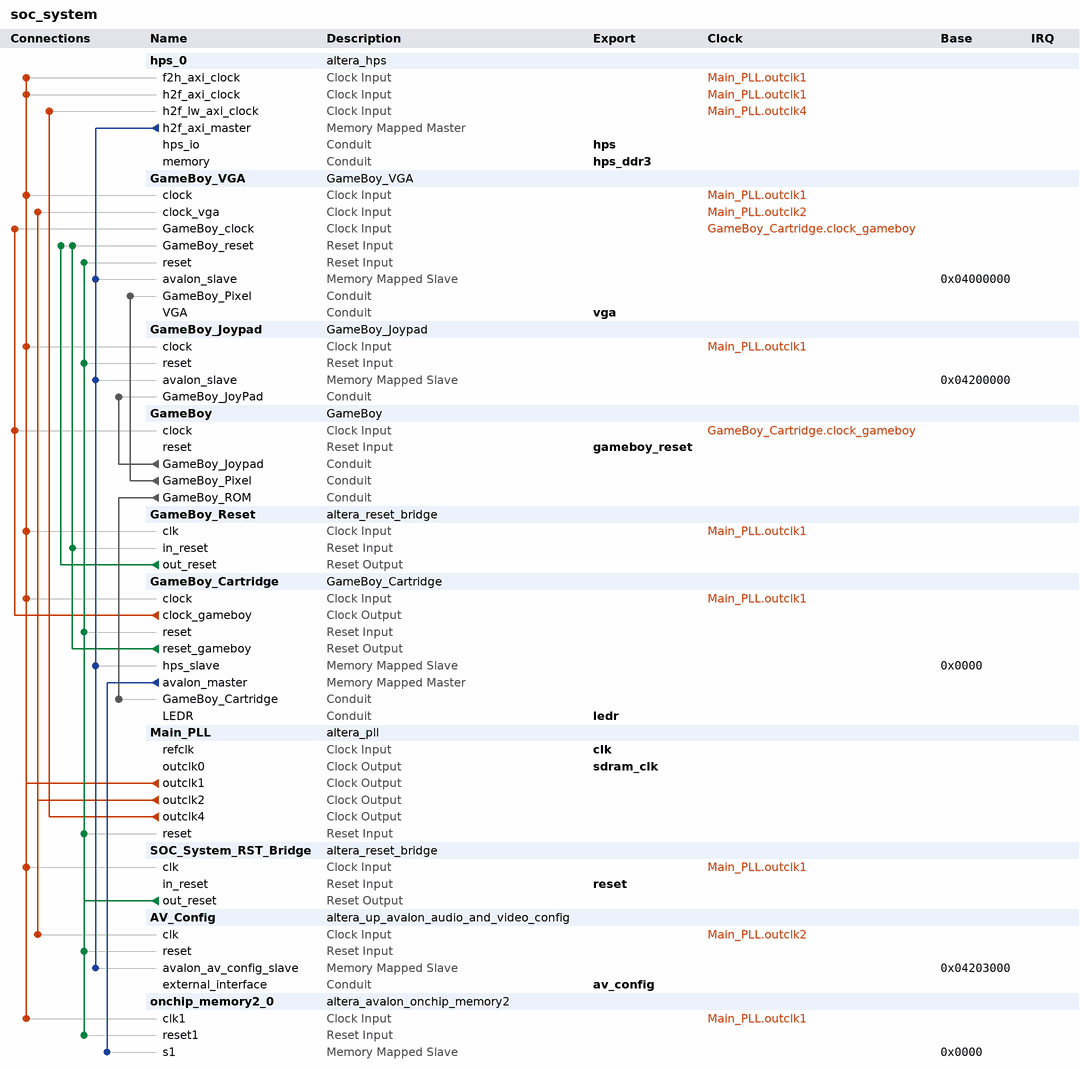
[diagram p0: system contents]
# Platform Designer (Qsys) system soc_system, Cyclone V 5CSEMA5F31C6
# Parameters at their usual value, and those the tool derives, are not listed.
package require -exact qsys 21.1
create_system soc_system
set_project_property DEVICE_FAMILY {Cyclone V}
set_project_property DEVICE 5CSEMA5F31C6

add_instance hps_0 altera_hps 21.1
set_instance_parameter_value hps_0 EMAC1_Mode RGMII
set_instance_parameter_value hps_0 EMAC1_PinMuxing {HPS I/O Set 0}
set_instance_parameter_value hps_0 F2SCLK_COLDRST_Enable false
set_instance_parameter_value hps_0 F2SCLK_DBGRST_Enable false
set_instance_parameter_value hps_0 F2SCLK_WARMRST_Enable false
set_instance_parameter_value hps_0 F2SINTERRUPT_Enable true
set_instance_parameter_value hps_0 F2S_Width 2
set_instance_parameter_value hps_0 FPGA_PERIPHERAL_OUTPUT_CLOCK_FREQ_EMAC0_GTX_CLK 125
set_instance_parameter_value hps_0 FPGA_PERIPHERAL_OUTPUT_CLOCK_FREQ_EMAC0_MD_CLK 2.5
set_instance_parameter_value hps_0 FPGA_PERIPHERAL_OUTPUT_CLOCK_FREQ_EMAC1_GTX_CLK 125
set_instance_parameter_value hps_0 FPGA_PERIPHERAL_OUTPUT_CLOCK_FREQ_EMAC1_MD_CLK 2.5
set_instance_parameter_value hps_0 HPS_PROTOCOL DDR3
set_instance_parameter_value hps_0 I2C0_Mode I2C
set_instance_parameter_value hps_0 I2C0_PinMuxing {HPS I/O Set 0}
set_instance_parameter_value hps_0 I2C1_Mode I2C
set_instance_parameter_value hps_0 I2C1_PinMuxing {HPS I/O Set 0}
set_instance_parameter_value hps_0 LWH2F_Enable true
set_instance_parameter_value hps_0 MEM_BANKADDR_WIDTH 3
set_instance_parameter_value hps_0 MEM_CLK_FREQ 400.0
set_instance_parameter_value hps_0 MEM_COL_ADDR_WIDTH 10
set_instance_parameter_value hps_0 MEM_DQ_WIDTH 32
set_instance_parameter_value hps_0 MEM_DRV_STR RZQ/7
set_instance_parameter_value hps_0 MEM_ROW_ADDR_WIDTH 15
set_instance_parameter_value hps_0 MEM_RTT_NOM RZQ/4
set_instance_parameter_value hps_0 MEM_RTT_WR RZQ/4
set_instance_parameter_value hps_0 MEM_TCL 11
set_instance_parameter_value hps_0 MEM_TFAW_NS 30.0
set_instance_parameter_value hps_0 MEM_TRAS_NS 35.0
set_instance_parameter_value hps_0 MEM_TRCD_NS 13.75
set_instance_parameter_value hps_0 MEM_TRFC_NS 260.0
set_instance_parameter_value hps_0 MEM_TRP_NS 13.75
set_instance_parameter_value hps_0 MEM_TRRD_NS 7.7
set_instance_parameter_value hps_0 MEM_VENDOR JEDEC
set_instance_parameter_value hps_0 MEM_WTCL 8
set_instance_parameter_value hps_0 QSPI_Mode N/A
set_instance_parameter_value hps_0 QSPI_PinMuxing Unused
set_instance_parameter_value hps_0 REF_CLK_FREQ 25.0
set_instance_parameter_value hps_0 S2FCLK_USER1CLK_Enable true
set_instance_parameter_value hps_0 S2FCLK_USER2CLK 5
set_instance_parameter_value hps_0 S2F_Width 2
set_instance_parameter_value hps_0 SDIO_Mode {4-bit Data}
set_instance_parameter_value hps_0 SDIO_PinMuxing {HPS I/O Set 0}
set_instance_parameter_value hps_0 SPIM1_Mode {Single Slave Select}
set_instance_parameter_value hps_0 SPIM1_PinMuxing {HPS I/O Set 0}
set_instance_parameter_value hps_0 STM_Enable false
set_instance_parameter_value hps_0 TIMING_BOARD_AC_SKEW 0.03
set_instance_parameter_value hps_0 TIMING_BOARD_AC_TO_CK_SKEW 0.0
set_instance_parameter_value hps_0 TIMING_BOARD_DQ_TO_DQS_SKEW 0.0
set_instance_parameter_value hps_0 TIMING_BOARD_MAX_CK_DELAY 0.03
set_instance_parameter_value hps_0 TIMING_BOARD_MAX_DQS_DELAY 0.02
set_instance_parameter_value hps_0 TIMING_BOARD_SKEW_BETWEEN_DQS 0.08
set_instance_parameter_value hps_0 TIMING_BOARD_SKEW_CKDQS_DIMM_MAX 0.16
set_instance_parameter_value hps_0 TIMING_BOARD_SKEW_CKDQS_DIMM_MIN 0.09
set_instance_parameter_value hps_0 TIMING_BOARD_SKEW_WITHIN_DQS 0.01
set_instance_parameter_value hps_0 TIMING_TDH 65
set_instance_parameter_value hps_0 TIMING_TDQSCK 255
set_instance_parameter_value hps_0 TIMING_TDQSQ 125
set_instance_parameter_value hps_0 TIMING_TDS 30
set_instance_parameter_value hps_0 TIMING_TIH 140
set_instance_parameter_value hps_0 TIMING_TIS 180
set_instance_parameter_value hps_0 TIMING_TQSH 0.4
set_instance_parameter_value hps_0 UART0_Mode {No Flow Control}
set_instance_parameter_value hps_0 UART0_PinMuxing {HPS I/O Set 0}
set_instance_parameter_value hps_0 USB1_Mode SDR
set_instance_parameter_value hps_0 USB1_PinMuxing {HPS I/O Set 0}
set_instance_parameter_value hps_0 desired_cfg_clk_mhz 100.0
set_instance_parameter_value hps_0 desired_qspi_clk_mhz 400.0

add_instance GameBoy_VGA GameBoy_VGA 1.0

add_instance GameBoy_Joypad GameBoy_Joypad 1.0

add_instance GameBoy GameBoy 1.0

add_instance GameBoy_Reset altera_reset_bridge 21.1
set_instance_parameter_value GameBoy_Reset ACTIVE_LOW_RESET 0
set_instance_parameter_value GameBoy_Reset SYNCHRONOUS_EDGES both

add_instance GameBoy_Cartridge GameBoy_Cartridge 1.0

add_instance Main_PLL altera_pll 21.1
set_instance_parameter_value Main_PLL gui_actual_output_clock_frequency2 {25.303342 MHz}
set_instance_parameter_value Main_PLL gui_device_speed_grade 2
set_instance_parameter_value Main_PLL gui_number_of_clocks 5
set_instance_parameter_value Main_PLL gui_operation_mode direct
set_instance_parameter_value Main_PLL gui_output_clock_frequency0 67.108864
set_instance_parameter_value Main_PLL gui_output_clock_frequency1 67.108864
set_instance_parameter_value Main_PLL gui_output_clock_frequency2 108.0
set_instance_parameter_value Main_PLL gui_output_clock_frequency3 12.288
set_instance_parameter_value Main_PLL gui_phase_shift0 -3000
set_instance_parameter_value Main_PLL gui_pll_mode {Fractional-N PLL}
set_instance_parameter_value Main_PLL gui_reference_clock_frequency 50.0
set_instance_parameter_value Main_PLL gui_use_locked false

add_instance SOC_System_RST_Bridge altera_reset_bridge 21.1
set_instance_parameter_value SOC_System_RST_Bridge ACTIVE_LOW_RESET 0
set_instance_parameter_value SOC_System_RST_Bridge SYNCHRONOUS_EDGES both

add_instance AV_Config altera_up_avalon_audio_and_video_config 18.0
set_instance_parameter_value AV_Config audio_in {Line In to ADC}
set_instance_parameter_value AV_Config bit_length 16
set_instance_parameter_value AV_Config board DE1-SoC
set_instance_parameter_value AV_Config line_in_bypass false
set_instance_parameter_value AV_Config sampling_rate {48 kHz}

add_instance onchip_memory2_0 altera_avalon_onchip_memory2 21.1
set_instance_parameter_value onchip_memory2_0 dataWidth 8
set_instance_parameter_value onchip_memory2_0 dualPort false
set_instance_parameter_value onchip_memory2_0 initMemContent true
set_instance_parameter_value onchip_memory2_0 initializationFileName onchip_mem.hex
set_instance_parameter_value onchip_memory2_0 memorySize 65536

# connections
add_connection GameBoy_Cartridge.clock_gameboy GameBoy.clock clock
add_connection GameBoy_Cartridge.clock_gameboy GameBoy_VGA.GameBoy_clock clock
add_connection Main_PLL.outclk1 GameBoy_Cartridge.clock clock
add_connection Main_PLL.outclk1 GameBoy_Joypad.clock clock
add_connection Main_PLL.outclk1 GameBoy_Reset.clk clock
add_connection Main_PLL.outclk1 GameBoy_VGA.clock clock
add_connection Main_PLL.outclk1 hps_0.f2h_axi_clock clock
add_connection Main_PLL.outclk1 hps_0.h2f_axi_clock clock
add_connection Main_PLL.outclk1 onchip_memory2_0.clk1 clock
add_connection Main_PLL.outclk1 SOC_System_RST_Bridge.clk clock
add_connection Main_PLL.outclk2 AV_Config.clk clock
add_connection Main_PLL.outclk2 GameBoy_VGA.clock_vga clock
add_connection Main_PLL.outclk4 hps_0.h2f_lw_axi_clock clock
add_connection GameBoy_Cartridge.reset_gameboy GameBoy_Reset.in_reset reset
add_connection GameBoy_Cartridge.reset_gameboy GameBoy_VGA.GameBoy_reset reset
add_connection GameBoy_Reset.out_reset GameBoy_VGA.GameBoy_reset reset
add_connection SOC_System_RST_Bridge.out_reset AV_Config.reset reset
add_connection SOC_System_RST_Bridge.out_reset GameBoy_Cartridge.reset reset
add_connection SOC_System_RST_Bridge.out_reset GameBoy_Joypad.reset reset
add_connection SOC_System_RST_Bridge.out_reset GameBoy_VGA.reset reset
add_connection SOC_System_RST_Bridge.out_reset Main_PLL.reset reset
add_connection SOC_System_RST_Bridge.out_reset onchip_memory2_0.reset1 reset
add_connection GameBoy_Cartridge.avalon_master onchip_memory2_0.s1 avalon
set_connection_parameter_value GameBoy_Cartridge.avalon_master/onchip_memory2_0.s1 baseAddress 0x0000
add_connection hps_0.h2f_axi_master AV_Config.avalon_av_config_slave avalon
set_connection_parameter_value hps_0.h2f_axi_master/AV_Config.avalon_av_config_slave baseAddress 0x04203000
add_connection hps_0.h2f_axi_master GameBoy_Cartridge.hps_slave avalon
set_connection_parameter_value hps_0.h2f_axi_master/GameBoy_Cartridge.hps_slave baseAddress 0x0000
add_connection hps_0.h2f_axi_master GameBoy_Joypad.avalon_slave avalon
set_connection_parameter_value hps_0.h2f_axi_master/GameBoy_Joypad.avalon_slave baseAddress 0x04200000
add_connection hps_0.h2f_axi_master GameBoy_VGA.avalon_slave avalon
set_connection_parameter_value hps_0.h2f_axi_master/GameBoy_VGA.avalon_slave baseAddress 0x04000000
add_connection GameBoy.GameBoy_Joypad GameBoy_Joypad.GameBoy_JoyPad conduit
add_connection GameBoy.GameBoy_Pixel GameBoy_VGA.GameBoy_Pixel conduit
add_connection GameBoy.GameBoy_ROM GameBoy_Cartridge.GameBoy_Cartridge conduit

# exported interfaces
add_interface av_config conduit end
set_interface_property av_config EXPORT_OF AV_Config.external_interface
add_interface clk clock sink
set_interface_property clk EXPORT_OF Main_PLL.refclk
add_interface gameboy_reset reset sink
set_interface_property gameboy_reset EXPORT_OF GameBoy.reset
add_interface hps conduit end
set_interface_property hps EXPORT_OF hps_0.hps_io
add_interface hps_ddr3 conduit end
set_interface_property hps_ddr3 EXPORT_OF hps_0.memory
add_interface ledr conduit end
set_interface_property ledr EXPORT_OF GameBoy_Cartridge.LEDR
add_interface reset reset sink
set_interface_property reset EXPORT_OF SOC_System_RST_Bridge.in_reset
add_interface sdram_clk clock source
set_interface_property sdram_clk EXPORT_OF Main_PLL.outclk0
add_interface vga conduit end
set_interface_property vga EXPORT_OF GameBoy_VGA.VGA

set_interconnect_requirement {$system} qsys_mm.clockCrossingAdapter HANDSHAKE
set_interconnect_requirement {$system} qsys_mm.enableEccProtection FALSE
set_interconnect_requirement {$system} qsys_mm.insertDefaultSlave FALSE
set_interconnect_requirement {$system} qsys_mm.maxAdditionalLatency 1

save_system soc_system.qsys
